# EAGLE design mainboard (EAGLE 9.6.2)
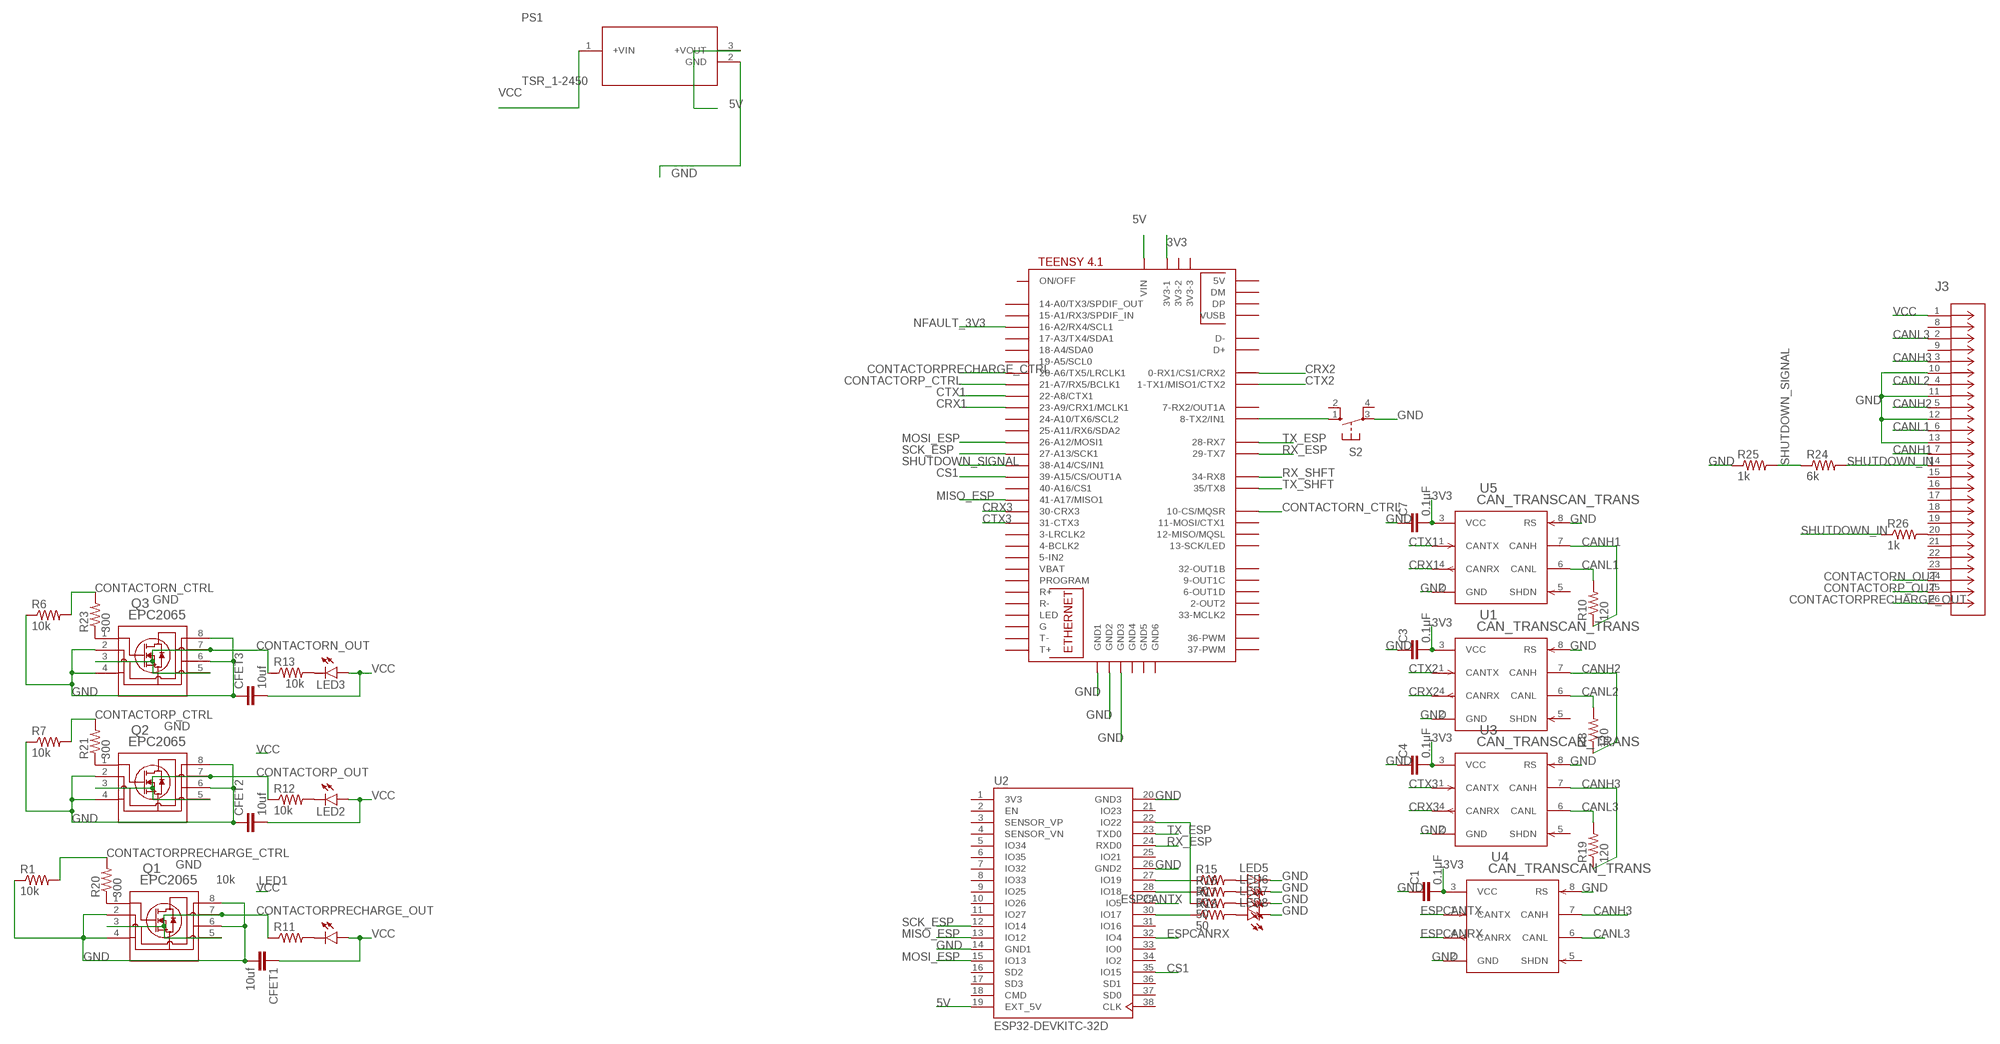
[diagram p0: schematic, sheet 1, part 1 of 2]
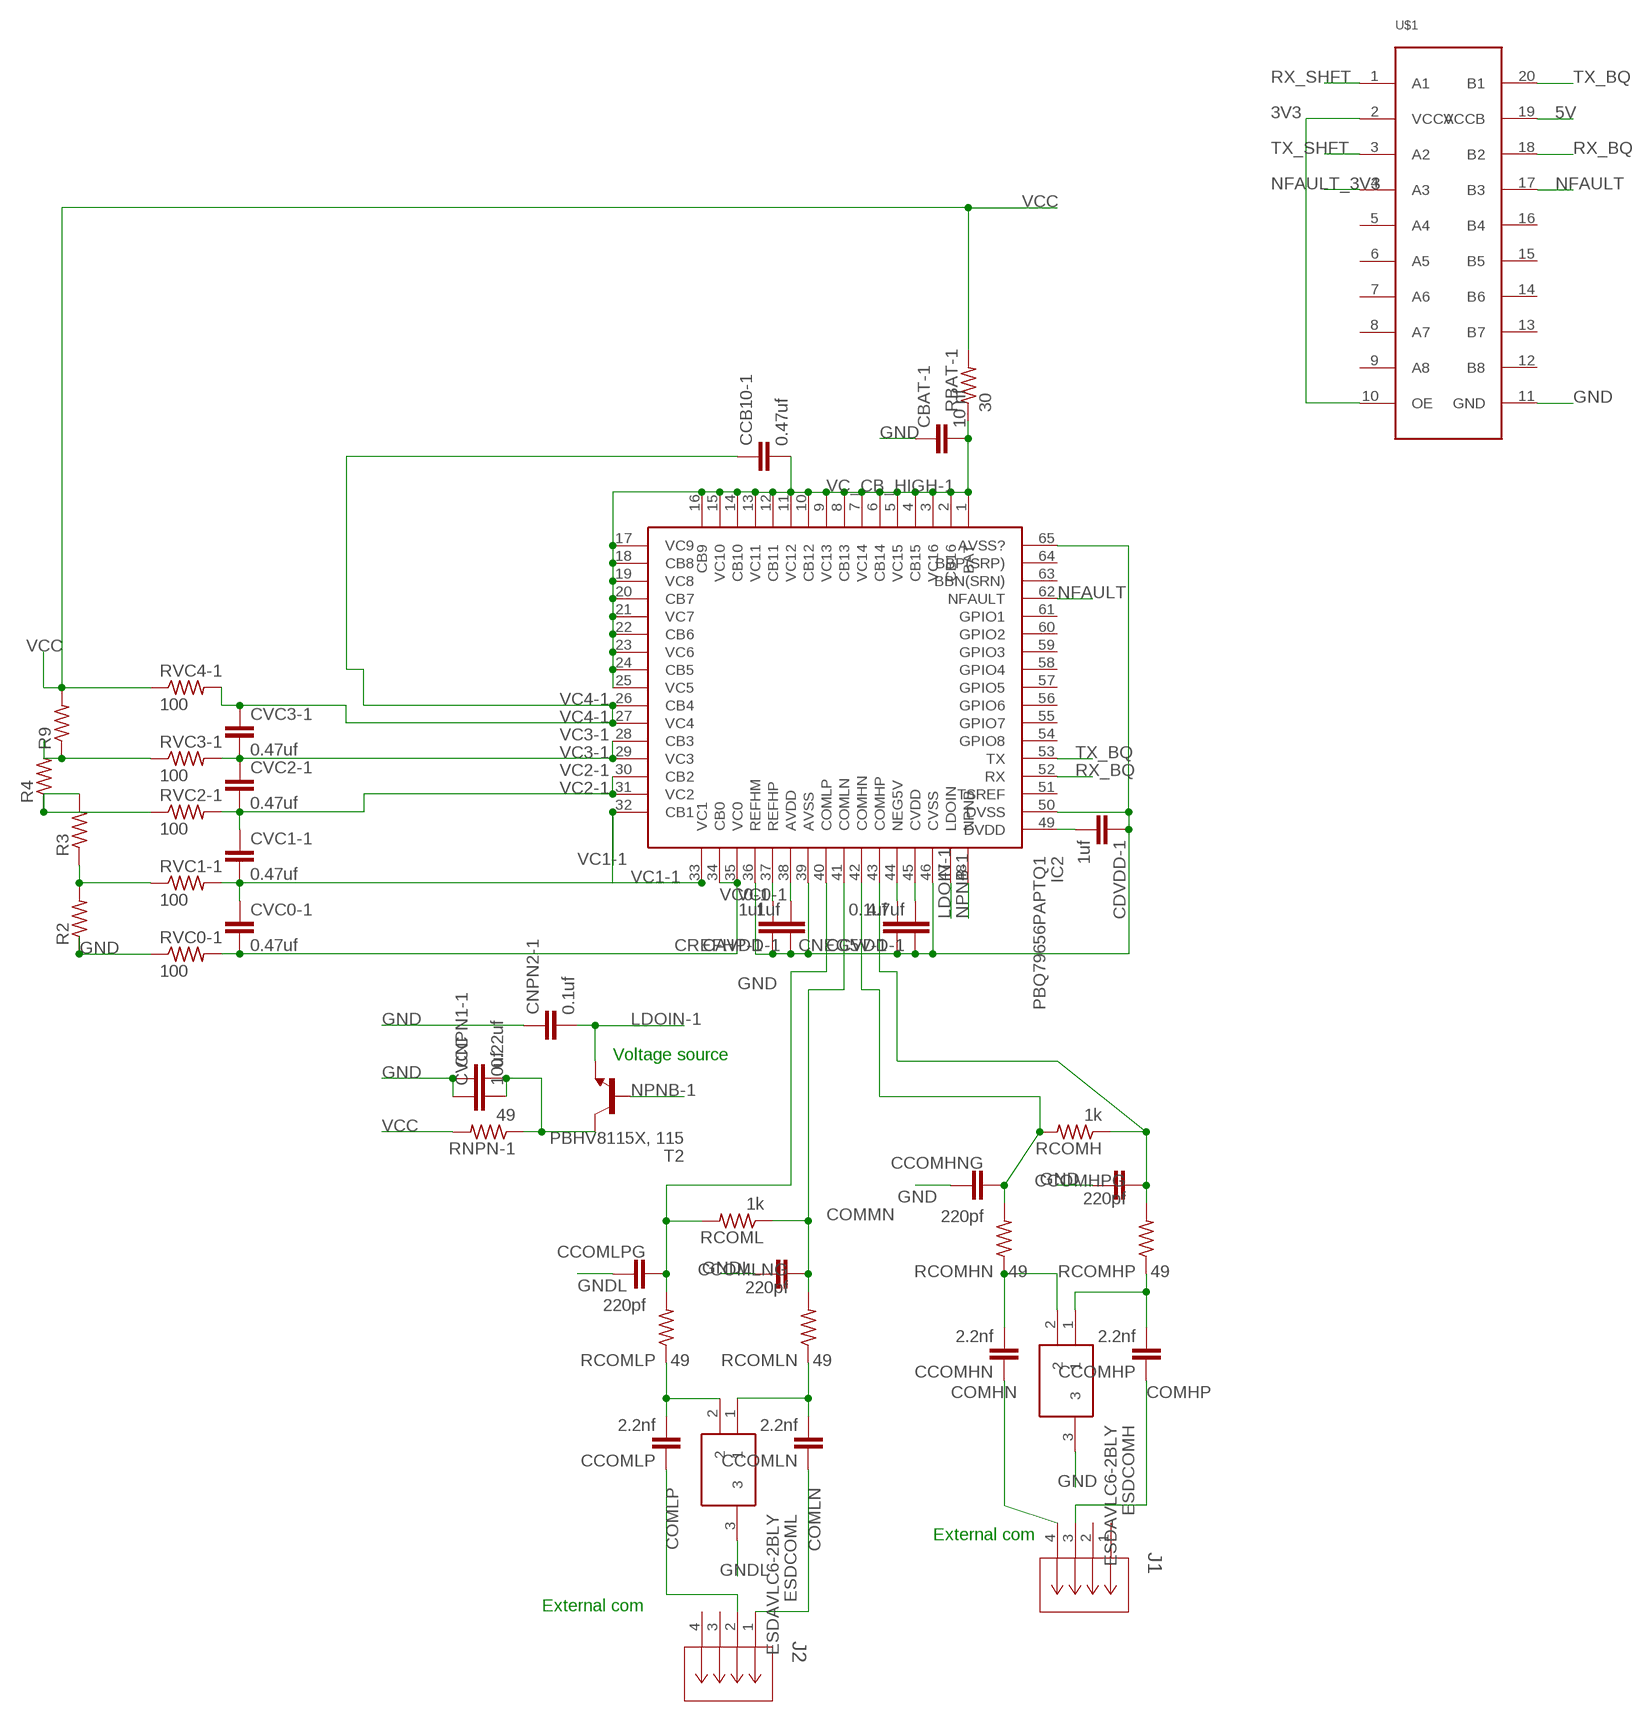
[diagram p1: schematic, sheet 1, part 2 of 2]

## Parts
C1  0.1μF  C-EUC0603  [C0603]
C3  0.1μF  C-EUC0603  [C0603]
C4  0.1μF  C-EUC0603  [C0603]
C7  0.1μF  C-EUC0603  [C0603]
CAVDD-1  1uf  C-EUC0603  [C0603]
CBAT-1  10 nf  C-EUC0603  [C0603]
CCB10-1  0.47uf  C-EUC0603  [C0603]
CCOMHN  2.2nf  C-EU075-032X103  [C075-032X103]
CCOMHNG  220pf  C-EUC0603  [C0603]
CCOMHP  2.2nf  C-EU075-032X103  [C075-032X103]
CCOMHPG  220pf  C-EUC0603  [C0603]
CCOMLN  2.2nf  C-EU075-032X103  [C075-032X103]
CCOMLNG  220pf  C-EUC0603  [C0603]
CCOMLP  2.2nf  C-EU075-032X103  [C075-032X103]
CCOMLPG  220pf  C-EUC0603  [C0603]
CCVDD-1  4.7uf  C-EUC0603  [C0603]
CDVDD-1  1uf  C-EUC0603  [C0603]
CFET1  10uf  C-EUC0805  [C0805]
CFET2  10uf  C-EUC0805  [C0805]
CFET3  10uf  C-EUC0805  [C0805]
CNEG5V-1  0.1uf  C-EUC0603  [C0603]
CNPN1-1  0.22uf  C-EUC0603  [C0603]
CNPN2-1  0.1uf  C-EUC0603  [C0603]
CREFHP-1  1uf  C-EUC0603  [C0603]
CVC0-1  0.47uf  C-EUC0603  [C0603]
CVC1-1  0.47uf  C-EUC0603  [C0603]
CVC2-1  0.47uf  C-EUC0603  [C0603]
CVC3-1  0.47uf  C-EUC0603  [C0603]
CVCC  10uf  C-EUC0805  [C0805]
ESDCOMH  ESDAVLC6-2BLY  [SOT95P255X150-3N]
ESDCOML  ESDAVLC6-2BLY  [SOT95P255X150-3N]
IC2  PBQ79656PAPTQ1  [QFP50P1200X1200X120-65N]
J1  DF11-4DP-2DSA(24)  [CON4_2X2_UF_DF11_HIR]
J2  DF11-4DP-2DSA(24)  [CON4_2X2_UF_DF11_HIR]
J3  TE_AMP_SURESEAL_26  [CONN26_6473423-1_TEC]
LED1  LEDSML0603  [SML0603]
LED2  LEDSML0603  [SML0603]
LED3  LEDSML0603  [SML0603]
LED5  LEDSML0603  [SML0603]
LED6  LEDSML0603  [SML0603]
LED7  LEDSML0603  [SML0603]
LED8  LEDSML0603  [SML0603]
PS1  TSR_1-2450  [TSR1-SINGLE_TRP]
Q1  EPC2065  [EPC2065_ECC]
Q2  EPC2065  [EPC2065_ECC]
Q3  EPC2065  [EPC2065_ECC]
R1  10k  R-US_R0603  [R0603]
R2  R-US_R0805  [R0805]
R3  R-US_R0805  [R0805]
R4  R-US_R0805  [R0805]
R6  10k  R-US_R0603  [R0603]
R7  10k  R-US_R0603  [R0603]
R8  120  R-US_R0603  [R0603]
R9  R-US_R0805  [R0805]
R10  120  R-US_R0603  [R0603]
R11  10k  R-US_R0603  [R0603]
R12  10k  R-US_R0603  [R0603]
R13  10k  R-US_R0603  [R0603]
R15  50  R-US_R0603  [R0603]
R16  50  R-US_R0603  [R0603]
R17  50  R-US_R0603  [R0603]
R18  50  R-US_R0603  [R0603]
R19  120  R-US_R0603  [R0603]
R20  300  R-US_R0603  [R0603]
R21  300  R-US_R0603  [R0603]
R23  300  R-US_R0603  [R0603]
R24  6k  R-US_R0603  [R0603]
R25  1k  R-US_R0603  [R0603]
R26  1k  R-US_R0603  [R0603]
RBAT-1  30  R-US_R0603  [R0603]
RCOMH  1k  R-US_R0603  [R0603]
RCOMHN  49  R-US_R0603  [R0603]
RCOMHP  49  R-US_R0603  [R0603]
RCOML  1k  R-US_R0603  [R0603]
RCOMLN  49  R-US_R0603  [R0603]
RCOMLP  49  R-US_R0603  [R0603]
RNPN-1  49  R-US_R0603  [R0603]
RVC0-1  100  R-US_R0603  [R0603]
RVC1-1  100  R-US_R0603  [R0603]
RVC2-1  100  R-US_R0603  [R0603]
RVC3-1  100  R-US_R0603  [R0603]
RVC4-1  100  R-US_R0603  [R0603]
S2  10-XX  [B3F-10XX]
T2  PBHV8115X, 115  BC868-NPN-SOT89-BCE  [SOT89-BCE]
U1  CAN_TRANSCAN_TRANS  [MAX3051ESA+]
U2  ESP32-DEVKITC-32D  [MODULE_ESP32-DEVKITC-32D]
U3  CAN_TRANSCAN_TRANS  [MAX3051ESA+]
U4  CAN_TRANSCAN_TRANS  [MAX3051ESA+]
U5  CAN_TRANSCAN_TRANS  [MAX3051ESA+]
U$1  TXB0108PWSMD  [TSSOP20]
U$3  TEENSY41  [TEENSY41]

## Nets
3V3: C1.2 C3.2 C4.2 C7.2 U1.3(VCC) U3.3(VCC) U4.3(VCC) U5.3(VCC) U$1.2(VCCA) U$1.10(OE) U$3.3V3-1
5V: PS1.3(+VOUT) U2.19(EXT_5V) U$1.19(VCCB) U$3.VIN
CANH1: J3.7 R10.1 U5.7(CANH)
CANH2: J3.5 R8.1 U1.7(CANH)
CANH3: J3.3 R19.1 U3.7(CANH) U4.7(CANH)
CANL1: J3.6 R10.2 U5.6(CANL)
CANL2: J3.4 R8.2 U1.6(CANL)
CANL3: J3.2 R19.2 U3.6(CANL) U4.6(CANL)
COMHN: CCOMHN.1 J1.4
COMHP: CCOMHP.1 J1.3
COMLN: CCOMLN.1 J2.1
COMLP: CCOMLP.1 J2.2
CONTACTORN_CTRL: R6.2 R23.2 U$3.10-CS\MQSR(10-CS/MQSR)
CONTACTORN_OUT: J3.24 Q3.3 Q3.5 Q3.7 R13.1
CONTACTORP_CTRL: R7.2 R21.2 U$3.21-A7/RX5/BCLK1
CONTACTORP_OUT: J3.25 Q2.3 Q2.5 Q2.7 R12.1
CONTACTORPRECHARGE_CTRL: R1.2 R20.2 U$3.20-A6/TX5/LRCLK1
CONTACTORPRECHARGE_OUT: J3.26 Q1.3 Q1.5 Q1.7 R11.1
CRX1: U5.4(CANRX) U$3.23-A9/CRX1/MCLK1
CRX2: U1.4(CANRX) U$3.0-RX1/CS1/CRX2
CRX3: U3.4(CANRX) U$3.30-CRX3
CS1: U2.35(IO15) U$3.39-A15/CS/OUT1A
CTX1: U5.1(CANTX) U$3.22-A8/CTX1
CTX2: U1.1(CANTX) U$3.1-TX1/MISO1/CTX2
CTX3: U3.1(CANTX) U$3.31-CTX3
CVDD-1: CCVDD-1.2 IC2.45(CVDD)
ESPCANRX: U2.32(IO4) U4.4(CANRX)
ESPCANTX: U2.29(IO5) U4.1(CANTX)
GND: C1.1 C3.1 C4.1 C7.1 CAVDD-1.1 CBAT-1.1 CCOMHNG.1 CCOMHPG.1 CCVDD-1.1 CDVDD-1.1 CFET1.2 CFET2.1 CFET3.1 CNEG5V-1.1 CNPN1-1.1 CNPN2-1.1 CREFHP-1.1 CVCC.1 ESDCOMH.3 IC2.36(REFHM) IC2.39(AVSS) IC2.46(CVSS) IC2.50(DVSS) IC2.65(AVSS?) J3.10 J3.11 J3.12 J3.13 LED5.C LED6.C LED7.C LED8.C PS1.2(GND) Q1.2 Q1.4 Q1.6 Q1.8 Q2.2 Q2.4 Q2.6 Q2.8 Q3.2 Q3.4 Q3.6 Q3.8 R1.1 R2.1 R6.1 R7.1 R25.1 RVC0-1.1 S2.3(P) U1.2(GND) U1.8(RS) U2.14(GND1) U2.20(GND3) U2.26(GND2) U3.2(GND) U3.8(RS) U4.2(GND) U4.8(RS) U5.2(GND) U5.8(RS) U$1.11(GND) U$3.GND1 U$3.GND2 U$3.GND3
GNDL: CCOMLNG.1 CCOMLPG.1 ESDCOML.3
LDOIN-1: CNPN2-1.2 IC2.47(LDOIN) T2.E
MISO_ESP: U2.13(IO12) U$3.41-A17/MISO1
MOSI_ESP: U2.15(IO13) U$3.26-A12/MOSI1
N$1: CCOMHP.2 ESDCOMH.1 RCOMHP.1
N$2: J3.20 R26.2
N$4: LED3.C R13.2
N$7: S2.1(S) U$3.8-TX2/IN1
N$8: CCOMHN.2 ESDCOMH.2 RCOMHN.1
N$9: LED2.C R12.2
N$10: CCOMLNG.2 IC2.41(COMLN) RCOML.1 RCOMLN.2
N$11: R17.1 U2.22(IO22)
N$13: LED1.C R11.2
N$15: Q1.1 R20.1
N$16: Q2.1 R21.1
N$28: R15.1 U2.27(IO19)
N$29: R16.1 U2.28(IO18)
N$30: Q3.1 R23.1
N$31: R18.1 U2.30(IO17)
N$32: LED5.A R15.2
N$33: LED6.A R16.2
N$34: LED7.A R17.2
N$35: LED8.A R18.2
N$49: CCOMLPG.2 IC2.40(COMLP) RCOML.2 RCOMLP.2
N$67: CCOMLP.2 ESDCOML.2 RCOMLP.1
N$68: CCOMLN.2 ESDCOML.1 RCOMLN.1
N$72: R3.2 R4.1 RVC2-1.1
N$73: R2.2 R3.1 RVC1-1.1
N$75: R4.2 R9.1 RVC3-1.1
N$111: CREFHP-1.2 IC2.37(REFHP)
N$112: CAVDD-1.2 IC2.38(AVDD)
N$113: CNEG5V-1.2 IC2.44(NEG5V)
N$114: CDVDD-1.2 IC2.49(DVDD)
N$130: CNPN1-1.2 CVCC.2 RNPN-1.1 T2.C
N$131: CCOMHPG.2 IC2.43(COMHP) RCOMH.1 RCOMHP.2
N$132: CCOMHNG.2 IC2.42(COMHN) RCOMH.2 RCOMHN.2
NFAULT: IC2.62(NFAULT) U$1.17(B3)
NFAULT_3V3: U$1.4(A3) U$3.16-A2/RX4/SCL1
NPNB-1: IC2.48(NPNB) T2.B
RX_BQ: IC2.52(RX) U$1.18(B2)
RX_ESP: U2.24(RXD0) U$3.29-TX7
RX_SHFT: U$1.1(A1) U$3.34-RX8
SCK_ESP: U2.12(IO14) U$3.27-A13/SCK1
SHUTDOWN_IN: J3.14 R24.2 R26.1
SHUTDOWN_SIGNAL: R24.1 R25.2 U$3.38-A14/CS/IN1
TX_BQ: IC2.53(TX) U$1.20(B1)
TX_ESP: U2.23(TXD0) U$3.28-RX7
TX_SHFT: U$1.3(A2) U$3.35-TX8(35/TX8)
VC0-1: CVC0-1.2 IC2.34(CB0) IC2.35(VC0) RVC0-1.2
VC1-1: CVC0-1.1 CVC1-1.2 IC2.32(CB1) IC2.33(VC1) RVC1-1.2
VC2-1: CVC1-1.1 CVC2-1.2 IC2.30(CB2) IC2.31(VC2) RVC2-1.2
VC3-1: CVC2-1.1 CVC3-1.2 IC2.28(CB3) IC2.29(VC3) RVC3-1.2
VC4-1: CCB10-1.1 CVC3-1.1 IC2.26(CB4) IC2.27(VC4) RVC4-1.2
VC_CB_HIGH-1: CBAT-1.2 CCB10-1.2 IC2.1(BAT) IC2.2(CB16) IC2.3(VC16) IC2.4(CB15) IC2.5(VC15) IC2.6(CB14) IC2.7(VC14) IC2.8(CB13) IC2.9(VC13) IC2.10(CB12) IC2.11(VC12) IC2.12(CB11) IC2.13(VC11) IC2.14(CB10) IC2.15(VC10) IC2.16(CB9) IC2.17(VC9) IC2.18(CB8) IC2.19(VC8) IC2.20(CB7) IC2.21(VC7) IC2.22(CB6) IC2.23(VC6) IC2.24(CB5) IC2.25(VC5) RBAT-1.1
VCC: CFET1.1 CFET2.2 CFET3.2 J3.1 LED1.A LED2.A LED3.A PS1.1(+VIN) R9.2 RBAT-1.2 RNPN-1.2 RVC4-1.1
Unconnected: IC2.51(TSREF) IC2.54(GPIO8) IC2.55(GPIO7) IC2.56(GPIO6) IC2.57(GPIO5) IC2.58(GPIO4) IC2.59(GPIO3) IC2.60(GPIO2) IC2.61(GPIO1) IC2.63(BBN(SRN)) IC2.64(BBP(SRP)) J1.1 J1.2 J2.3 J2.4 J3.8 J3.9 J3.15 J3.16 J3.17 J3.18 J3.19 J3.21 J3.22 J3.23 S2.2(S1) S2.4(P1) U1.5(SHDN) U2.2(EN) U2.3(SENSOR_VP) U2.4(SENSOR_VN) U2.5(IO34) U2.6(IO35) U2.7(IO32) U2.8(IO33) U2.9(IO25) U2.10(IO26) U2.11(IO27) U2.16(SD2) U2.17(SD3) U2.18(CMD) U2.21(IO23) U2.25(IO21) U2.31(IO16) U2.33(IO0) U2.34(IO2) U2.36(SD1) U2.37(SD0) U2.38(CLK) U3.5(SHDN) U4.5(SHDN) U5.5(SHDN) U$1.5(A4) U$1.6(A5) U$1.7(A6) U$1.8(A7) U$1.9(A8) U$1.12(B8) U$1.13(B7) U$1.14(B6) U$1.15(B5) U$1.16(B4) U$3.2-OUT2 U$3.3-LRCLK2 U$3.3V3-2 U$3.3V3-3 U$3.4-BCLK2 U$3.5-IN2 U$3.6-OUT1D U$3.7-RX2/OUT1A U$3.9-OUT1C U$3.11-MOSI/CTX1 U$3.12-MISO/MQSL U$3.13-SCK/LED U$3.14-A0/TX3/SPDIF_OUT U$3.15-A1/RX3/SPDIF_IN U$3.17-A3/TX4/SDA1 U$3.18-A4/SDA0 U$3.19-A5/SCL0 U$3.24-A10/TX6/SCL2 U$3.25-A11/RX6/SDA2 U$3.32-OUT1B U$3.33-MCLK2 U$3.36-PWM U$3.37-PWM U$3.40-A16/CS1 U$3.+5V(5V) U$3.D+ U$3.D- U$3.DM U$3.DP U$3.G U$3.GND4 U$3.GND5 U$3.GND6 U$3.LED U$3.ON/OFF U$3.PROGRAM U$3.R+ U$3.R- U$3.T+ U$3.T- U$3.VBAT U$3.VUSB

## Notes on the sheet
- Voltage source
- External com
- External com

## Power pins joined to a net without a drawn wire
3V3: U2.1(3V3)

## Library data of the parts
C1 C3 C4 C7 CAVDD-1 CBAT-1 CCB10-1 CCOMHN CCOMHNG CCOMHP CCOMHPG CCOMLN CCOMLNG CCOMLP CCOMLPG CCVDD-1 CDVDD-1 CFET1-CFET3 CNEG5V-1 CNPN1-1 CNPN2-1 CREFHP-1 CVC0-1 CVC1-1 CVC2-1 CVC3-1 CVCC = rcl:C-EU: CAPACITOR, European symbol; SPICEPREFIX: C
ESDCOMH ESDCOML = ESDAVLC6-2BLY:ESDAVLC6-2BLY: STMICROELECTRONICS - ESDAVLC6-2BLY - ESD Protection Device, 17 V, SOT-23, 3 Pins, 5 V, 140 W, ESDA Transil Series Source: Datasheet <http://www.st.com/resource/en/datasheet/esdavlc6-2bly.pdf>; DESCRIPTION: STMICROELECTRONICS - ESDAVLC6-2BLY - ESD Protection Device, 17 V, SOT-23, 3 Pins, 5 V, 140 W, ESDA Transil Series; HEIGHT: 1.5mm; MANUFACTURER_NAME: STMicroelectronics; MANUFACTURER_PART_NUMBER: ESDAVLC6-2BLY; MOUSER_PART_NUMBER: 511-ESDAVLC6-2BLY; MOUSER_PRICE-STOCK: https://www.mouser.co.uk/ProductDetail/STMicroelectronics/ESDAVLC6-2BLY?qs=l7cgNqFNU1iH2e21evvYsA%3D%3D
IC2 = PBQ79656PAPTQ1:PBQ79656PAPTQ1: BQ7965x-Q1 Family of 12S, 14S, 16S Precision Automotive Battery Monitor, Balancer and Integrated Hardware Protector with up to SafeTITM-26262 ASIL-D Compliance Source: Datasheet <http://www.ti.com/lit/ds/symlink/bq79616-q1.pdf>; DESCRIPTION: BQ7965x-Q1 Family of 12S, 14S, 16S Precision Automotive Battery Monitor, Balancer and Integrated Hardware Protector with up to SafeTITM-26262 ASIL-D Compliance; HEIGHT: 1.2mm; MANUFACTURER_NAME: Texas Instruments; MANUFACTURER_PART_NUMBER: PBQ79656PAPTQ1
J1 J2 = hirose_connectors:DF11-4DP-2DSA(24); COPYRIGHT: Copyright (C) 2023 Ultra Librarian. All rights reserved.; DIGI-KEY_PART_NUMBER_1: H10229-ND; MANUFACTURER_PART_NUMBER: DF11-4DP-2DSA(24); MFR_NAME: Hirose
J3 = TE_Sureseal:TE_AMP_SURESEAL_26; COPYRIGHT: Copyright (C) 2023 Ultra Librarian. All rights reserved.; DIGIKEY_PART_NUMBER_1: 6473423-1-ND; MANUFACTURER_PART_NUMBER: 6473423-1; MFR_NAME: TE Connectivity
LED1-LED3 LED5-LED8 = led:LED: LED OSRAM: - CHIPLED LG R971, LG N971, LY N971, LG Q971, LY Q971, LO R971, LY R971 LH N974, LH R974 LS Q976, LO Q976, LY Q976 LO Q996 - Hyper CHIPLED LW Q18S LB Q993, LB Q99A, LB R99A - SideLED LS A670, LO A670, LY A670, LG A670, LP A670 LB A673, LV A673, LT A673, LW A673 LH A674 LY A675 LS A676, LA A676, LO A676, LY A676, LW A676 LS A679, LY A679, LG A679 - Hyper Micro SIDELED® LS Y876, LA Y876, LO Y876, LY Y876 LT Y87S - SmartLED LW L88C, LW L88S LB L89C, LB L89S, LG L890 LS L89K, LO L89K, LY L89K LS L896, LA L896, LO L896, LY L896 - TOPLED LS T670, LO T670, LY T670, LG T670, LP T670 LSG T670, LSP T670, LSY T670, LOP T670, LYG T670 LG T671, LOG T671, LSG T671 LB T673, LV T673, LT T673, LW T673 LH T674 LS T676, LA T676, LO T676, LY T676, LB T676, LH T676, LSB T676, LW T676 LB T67C, LV T67C, LT T67C, LS T67K, LO T67K, LY T67K, LW E67C LS E67B, LA E67B, LO E67B, LY E67B, LB E67C, LV E67C, LT E67C LW T67C LS T679, LY T679, LG T679 LS T770, LO T770, LY T770, LG T770, LP T770 LB T773, LV T773, LT T773, LW T773 LH T774 LS E675, LA E675, LY E675, LS T675 LS T776, LA T776, LO T776, LY T776, LB T776 LHGB T686 LT T68C, LB T68C - Hyper Mini TOPLED® LB M676 - Mini TOPLED Santana® LG M470 LS M47K, LO M47K, LY M47K Source: http://www.osram.convergy.de LUXEON: - LUMILED® LXK2-PW12-R00, LXK2-PW12-S00, LXK2-PW14-U00, LXK2-PW14-V00 LXK2-PM12-R00, LXK2-PM12-S00, LXK2-PM14-U00 LXK2-PE12-Q00, LXK2-PE12-R00, LXK2-PE12-S00, LXK2-PE14-T00, LXK2-PE14-U00 LXK2-PB12-K00, LXK2-PB12-L00, LXK2-PB12-M00, LXK2-PB14-N00, LXK2-PB14-P00, LXK2-PB14-Q00 LXK2-PR12-L00, LXK2-PR12-M00, LXK2-PR14-Q00, LXK2-PR14-R00 LXK2-PD12-Q00, LXK2-PD12-R00, LXK2-PD12-S00 LXK2-PH12-R00, LXK2-PH12-S00 LXK2-PL12-P00, LXK2-PL12-Q00, LXK2-PL12-R00 Source: www.luxeon.com KINGBRIGHT: KA-3528ASYC Source: www.kingbright.com
PS1 = dcdc_5v:TSR_1-2450; COPYRIGHT: Copyright (C) 2023 Ultra Librarian. All rights reserved.; DIGI-KEY_PART_NUMBER_1: 1951-2747-ND; MANUFACTURER_PART_NUMBER: TSR 1-2450; MFR_NAME: Traco Power
Q1-Q3 = EPCGaNFET:EPC2065; COPYRIGHT: Copyright (C) 2023 Ultra Librarian. All rights reserved.; DIGIKEY_PART_NUMBER_1: 917-EPC2065TR-ND; DIGIKEY_PART_NUMBER_2: 917-EPC2065CT-ND; DIGIKEY_PART_NUMBER_3: 917-EPC2065DKR-ND; MANUFACTURER_PART_NUMBER: EPC2065; MFR_NAME: EPC
R1-R4 R6-R13 R15-R21 R23-R26 RBAT-1 RCOMH RCOMHN RCOMHP RCOML RCOMLN RCOMLP RNPN-1 RVC0-1 RVC1-1 RVC2-1 RVC3-1 RVC4-1 = rcl:R-US_: RESISTOR, American symbol; SPICEPREFIX: R
S2 = switch-omron:10-XX: OMRON SWITCH; MPN: B3F-1000; OC_FARNELL: 176432; OC_NEWARK: 36M3542
T2 = transistor:*-NPN-: NPN Transistror BF959 corrected 2008.03.06
U1 U3-U5 = NFR23_v1.1:CAN_TRANS; COPYRIGHT: Copyright (C) 2022 Ultra Librarian. All rights reserved.; DIGI-KEY_PART_NUMBER_1: MAX3051ESA+-ND; MANUFACTURER_PART_NUMBER: MAX3051ESA+; MFR_NAME: Maxim Integrated Products
U2 = ESP32-DEVKITC-32D:ESP32-DEVKITC-32D: Eval Board For Esp-Wroom-32 Check availability <https://pricing.snapeda.com/parts/ESP32-DEVKITC-32D/Espressif%20Systems/view-part?ref=eda>; AVAILABILITY: In Stock; DESCRIPTION: WiFi Development Tools (802.11) ESP32 General Development Kit, ESP32-WROOM-32D on the board; MF: Espressif Systems; MP: ESP32-DEVKITC-32D; PACKAGE: None; PRICE: None; PURCHASE-URL: https://pricing.snapeda.com/search/part/ESP32-DEVKITC-32D/?ref=eda
U$1 = TB0108:TXB0108PW
U$3 = teensy:TEENSY41

## Board
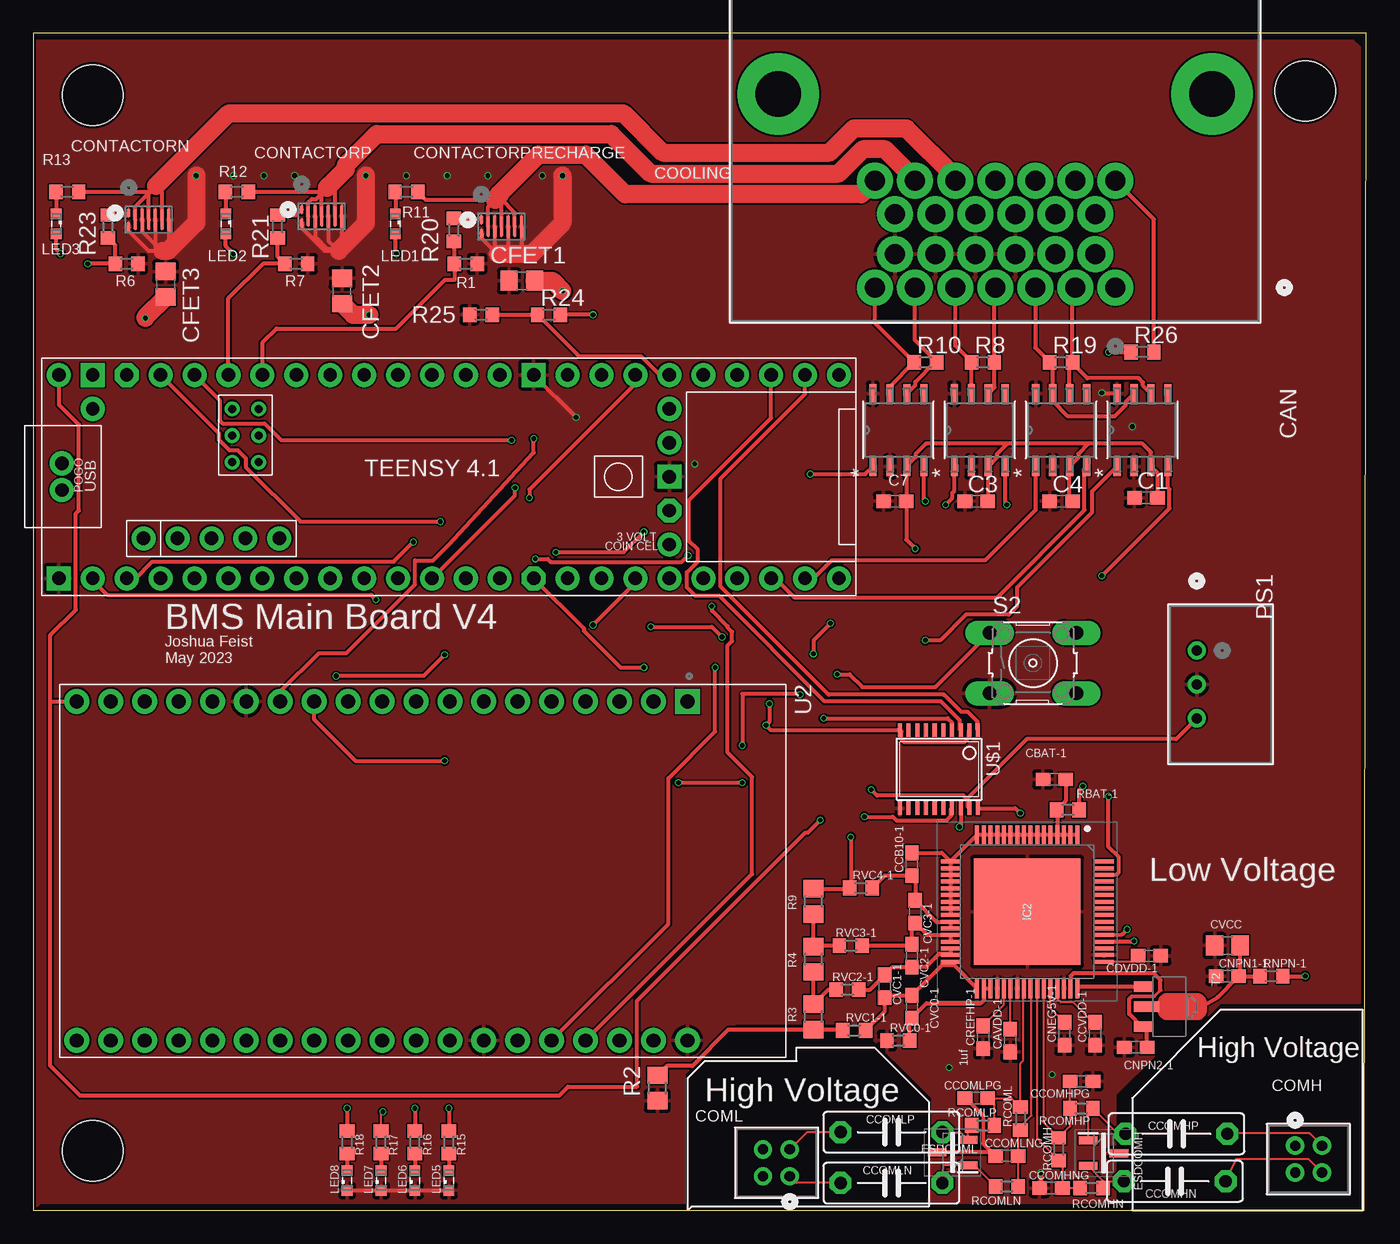
[diagram p2: board, top side]
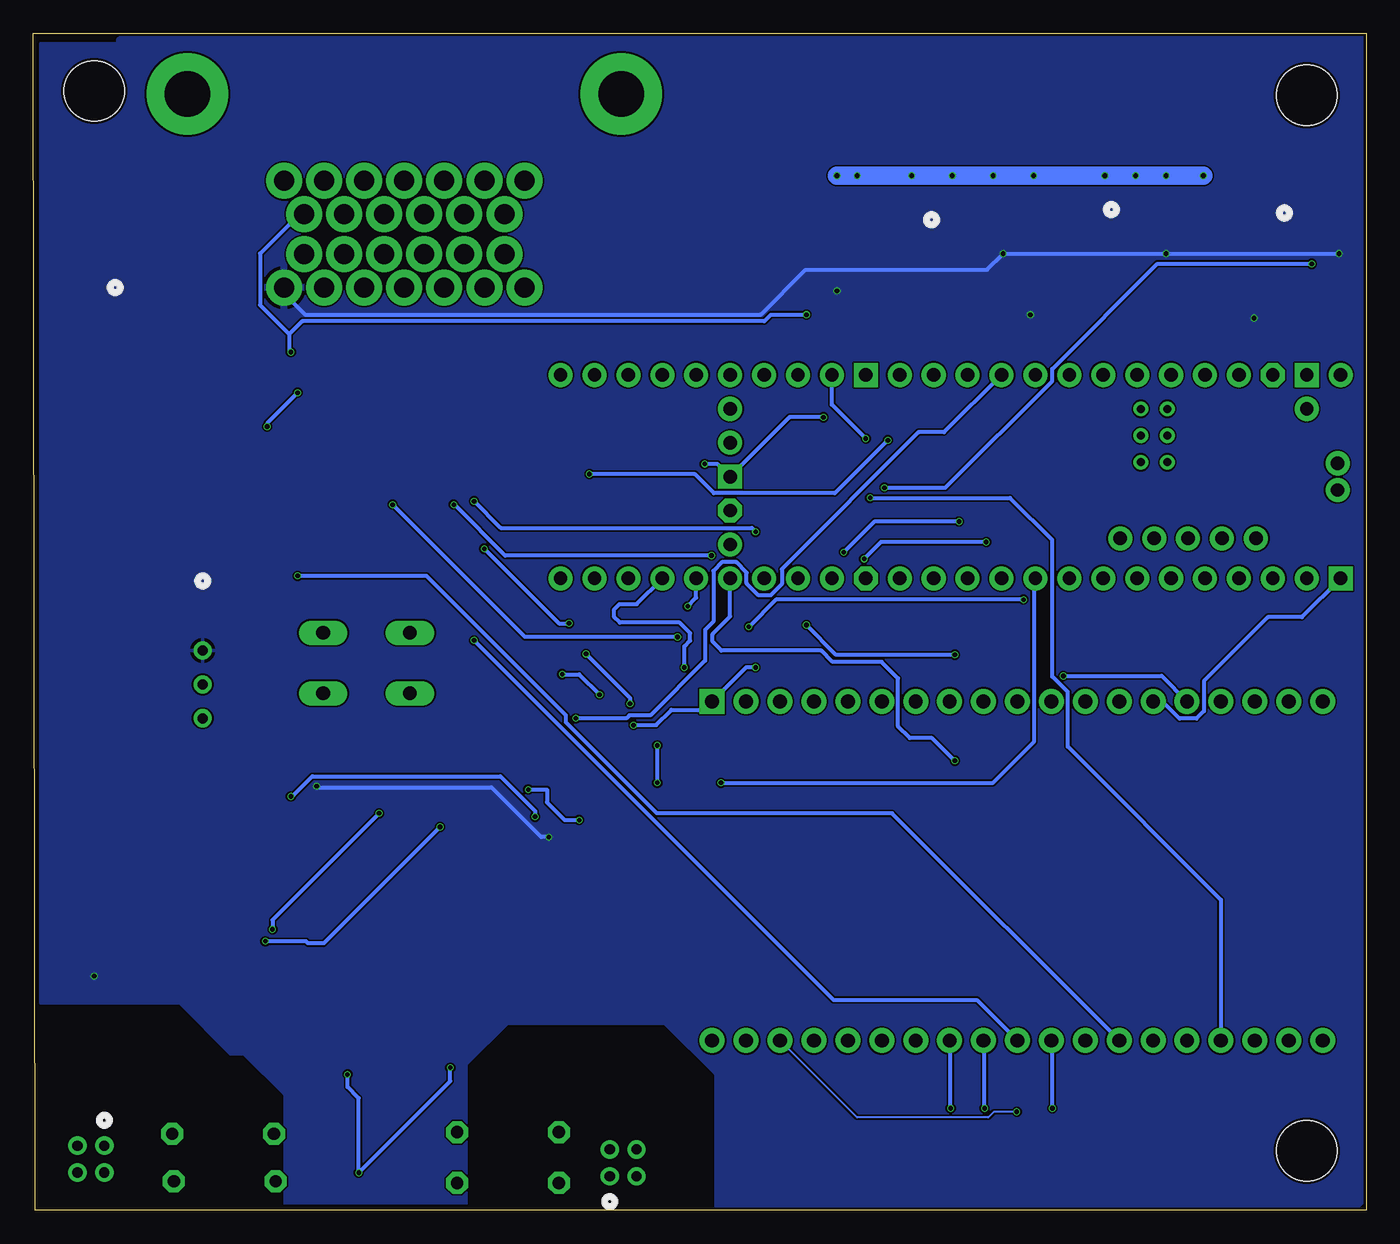
[diagram p3: board, bottom side, seen from below]

Size 99.8 x 88.13 mm. Coordinates in mm from the lower left corner, seen from the top.
Outline: 0,0 99.67,0 99.8,88.13 0,88.13 0,0
Copper layers (1*16): Top 0.035mm / dielectric 1.6mm / Bottom 0.035mm
Design rules "jlcpcb-2layers": minimum track width 5mil, minimum drill 0.3mm, track to track 5mil, track to pad 5mil, pad to pad 5mil, via to via 5mil, smd to smd 5mil, copper to edge 0.2mm, drill to drill 6mil, minimum pad ring 10mil, minimum via ring 3mil, stop-mask expansion 4mil, vias tented up to drill 0mil, thermal gap 10mil
Holes 4.52 mm at 4.45,4.45 95.25,83.82 4.45,83.5

### Footprints (pad centres in the part's own frame; a part is rotated, then mirrored left to right if it is on the bottom)
C0603 = smd 1.1 x 1: 1 -0.85,0; 2 0.85,0
C075-032X103 = drill 0.914 octagon: 1 -3.81,0; 2 3.81,0
C0805 = smd 1.3 x 1.5: 1 -0.95,0; 2 0.95,0
SOT95P255X150-3N = smd 1.4 x 0.6: 1 -1.15,0.95; 2 -1.15,-0.95; 3 1.15,0
QFP50P1200X1200X120-65N = smd 1.475 x 0.3: 1 -5.738,3.75; 2 -5.738,3.25; 3 -5.738,2.75; 4 -5.738,2.25; 5 -5.738,1.75; 6 -5.738,1.25; 7 -5.738,0.75; 8 -5.738,0.25; 9 -5.738,-0.25; 10 -5.738,-0.75; 11 -5.738,-1.25; 12 -5.738,-1.75; 13 -5.738,-2.25; 14 -5.738,-2.75; 15 -5.738,-3.25; 16 -5.738,-3.75; 33 5.738,-3.75; 34 5.738,-3.25; 35 5.738,-2.75; 36 5.738,-2.25; 37 5.738,-1.75; 38 5.738,-1.25; 39 5.738,-0.75; 40 5.738,-0.25; 41 5.738,0.25; 42 5.738,0.75; 43 5.738,1.25; 44 5.738,1.75; 45 5.738,2.25; 46 5.738,2.75; 47 5.738,3.25; 48 5.738,3.75 | smd 0.3 x 1.475: 17 -3.75,-5.738; 18 -3.25,-5.738; 19 -2.75,-5.738; 20 -2.25,-5.738; 21 -1.75,-5.738; 22 -1.25,-5.738; 23 -0.75,-5.738; 24 -0.25,-5.738; 25 0.25,-5.738; 26 0.75,-5.738; 27 1.25,-5.738; 28 1.75,-5.738; 29 2.25,-5.738; 30 2.75,-5.738; 31 3.25,-5.738; 32 3.75,-5.738; 49 3.75,5.738; 50 3.25,5.738; 51 2.75,5.738; 52 2.25,5.738; 53 1.75,5.738; 54 1.25,5.738; 55 0.75,5.738; 56 0.25,5.738; 57 -0.25,5.738; 58 -0.75,5.738; 59 -1.25,5.738; 60 -1.75,5.738; 61 -2.25,5.738; 62 -2.75,5.738; 63 -3.25,5.738; 64 -3.75,5.738 | smd 8 x 8: 65 0,0
CON4_2X2_UF_DF11_HIR = drill 0.762 pad 1.27: 1 0,0; 2 0,2.007; 3 -2.007,0; 4 -2.007,2.007
CONN26_6473423-1_TEC = drill 1.499 pad 2.007: 1 0,0; 2 2.997,0; 3 5.994,0; 4 8.992,0; 5 11.989,0; 6 15.011,0; 7 18.009,0; 8 1.499,-2.489; 9 4.496,-2.489; 10 7.493,-2.489; 11 10.49,-2.489; 12 13.487,-2.489; 13 16.51,-2.489; 14 1.499,-5.512; 15 4.496,-5.512; 16 7.493,-5.512; 17 10.49,-5.512; 18 13.487,-5.512; 19 16.51,-5.512; 20 0,-8.001; 21 2.997,-8.001; 22 5.994,-8.001; 23 8.992,-8.001; 24 11.989,-8.001; 25 15.011,-8.001; 26 18.009,-8.001 | drill 3.404 pad 3.404: 27 -7.239,-14.503; 28 25.248,-14.503
SML0603 = smd 0.8 x 0.8: A 0.75,0; C -0.75,0
TSR1-SINGLE_TRP = drill 0.762 pad 1.27: 1 0,0; 2 2.54,0; 3 5.08,0
EPC2065_ECC = smd 0.229 x 0.762: 1 -1.5,0.512; 2 -1.5,-0.512 | smd 0.229 x 1.6: 3 -1,0; 5 0,0; 7 1,0 | smd 0.229 x 1.778: 4 -0.5,0; 6 0.5,0; 8 1.5,0
R0603 = smd 1 x 1.1: 1 -0.85,0; 2 0.85,0
R0805 = smd 1.3 x 1.5: 1 -0.95,0; 2 0.95,0
B3F-10XX = drill 1.016 long: 1 -3.251,2.261; 2 3.251,2.261; 3 -3.251,-2.261; 4 3.251,-2.261
SOT89-BCE = smd 0.8 x 1.4: B -1.499,-1.981; E 1.499,-1.981 | smd 0.8 x 1.9: C 0,-1.727
MAX3051ESA+ = smd 1.46 x 0.533: 1 -2.724,1.905; 2 -2.724,0.635; 3 -2.724,-0.635; 4 -2.724,-1.905; 5 2.724,-1.905; 6 2.724,-0.635; 7 2.724,0.635; 8 2.724,1.905
MODULE_ESP32-DEVKITC-32D = drill 1.04 square: 1 -12.7,19.76 | drill 1.04: 2 -12.7,17.22; 3 -12.7,14.68; 4 -12.7,12.14; 5 -12.7,9.6; 6 -12.7,7.06; 7 -12.7,4.52; 8 -12.7,1.98; 9 -12.7,-0.56; 10 -12.7,-3.1; 11 -12.7,-5.64; 12 -12.7,-8.18; 13 -12.7,-10.72; 14 -12.7,-13.26; 15 -12.7,-15.8; 16 -12.7,-18.34; 17 -12.7,-20.88; 18 -12.7,-23.42; 19 -12.7,-25.96; 20 12.7,19.76; 21 12.7,17.22; 22 12.7,14.68; 23 12.7,12.14; 24 12.7,9.6; 25 12.7,7.06; 26 12.7,4.52; 27 12.7,1.98; 28 12.7,-0.56; 29 12.7,-3.1; 30 12.7,-5.64; 31 12.7,-8.18; 32 12.7,-10.72; 33 12.7,-13.26; 34 12.7,-15.8; 35 12.7,-18.34; 36 12.7,-20.88; 37 12.7,-23.42; 38 12.7,-25.96
TSSOP20 = smd 0.305 x 0.991: 1 -2.925,-2.918; 2 -2.275,-2.918; 3 -1.625,-2.918; 4 -0.975,-2.918; 5 -0.325,-2.918; 6 0.325,-2.918; 7 0.975,-2.918; 8 1.625,-2.918; 9 2.275,-2.918; 10 2.925,-2.918; 11 2.925,2.918; 12 2.275,2.918; 13 1.625,2.918; 14 0.975,2.918; 15 0.325,2.918; 16 -0.325,2.918; 17 -0.975,2.918; 18 -1.625,2.918; 19 -2.275,2.918; 20 -2.925,2.918
TEENSY41 = drill 1: 0-RX1/CS1/CRX2 -27.94,-7.62; 1-TX1/MISO1/CTX2 -25.4,-7.62; 2-OUT2 -22.86,-7.62; 3-LRCLK2 -20.32,-7.62; 4-BCLK2 -17.78,-7.62; 5-IN2 -15.24,-7.62; 6-OUT1D -12.7,-7.62; 7-RX2/OUT1A -10.16,-7.62; 8-TX2/IN1 -7.62,-7.62; 9-OUT1C -5.08,-7.62; 10-CS\MQSR -2.54,-7.62; 11-MOSI/CTX1 0,-7.62; 12-MISO/MQSL 2.54,-7.62; 13-SCK/LED 2.54,7.62; 14-A0/TX3/SPDIF_OUT 0,7.62; 15-A1/RX3/SPDIF_IN -2.54,7.62; 16-A2/RX4/SCL1 -5.08,7.62; 17-A3/TX4/SDA1 -7.62,7.62; 18-A4/SDA0 -10.16,7.62; 19-A5/SCL0 -12.7,7.62; 20-A6/TX5/LRCLK1 -15.24,7.62; 21-A7/RX5/BCLK1 -17.78,7.62; 22-A8/CTX1 -20.32,7.62; 23-A9/CRX1/MCLK1 -22.86,7.62; 24-A10/TX6/SCL2 7.62,-7.62; 25-A11/RX6/SDA2 10.16,-7.62; 26-A12/MOSI1 12.7,-7.62; 27-A13/SCK1 15.24,-7.62; 28-RX7 17.78,-7.62; 29-TX7 20.32,-7.62; 30-CRX3 22.86,-7.62; 31-CTX3 25.4,-7.62; 32-OUT1B 27.94,-7.62; 33-MCLK2 27.94,7.62; 34-RX8 25.4,7.62; 35-TX8 22.86,7.62; 36-PWM 20.32,7.62; 37-PWM 17.78,7.62; 38-A14/CS/IN1 15.24,7.62; 39-A15/CS/OUT1A 12.7,7.62; 40-A16/CS1 10.16,7.62; 41-A17/MISO1 7.62,7.62; +5V -24.13,-4.62; D+ -30.25,-1; D- -30.25,1; DM -21.59,-4.62; DP -19.05,-4.62; GND4 -16.51,-4.62; GND5 -13.97,-4.62; ON/OFF 15.24,5.08; PROGRAM 15.24,2.54; VBAT 15.24,-5.08; VUSB -27.94,5.08 | drill 1 octagon: 3V3-1 5.08,-7.62; 3V3-2 15.24,-2.54; 3V3-3 -25.4,7.62 | drill 0.6: G -15.51,3.08; LED -17.51,3.08; R+ -17.51,5.08; R- -15.51,5.08; T+ -15.51,1.08; T- -17.51,1.08 | drill 1 square: GND1 -30.48,-7.62; GND2 15.24,0; GND3 5.08,7.62; GND6 -27.94,7.62 | drill 1 pad 1.676: VIN -30.48,7.62

### Placement (x,y rotation side)
C1  83.31,53.34 0 top
C3  70.61,53.09 0 top
C4  76.96,53.09 0 top
C7  64.52,53.09 0 top
CAVDD-1  73.15,12.7 90 top
CBAT-1  76.45,32.26 0 top
CCB10-1  65.79,25.91 90 top
CCOMHN  85.47,2.16 180 top
CCOMHNG  76.2,1.65 0 top
CCOMHP  85.6,5.71 180 top
CCOMHPG  78.49,9.65 180 top
CCOMLN  64.26,2.03 0 top
CCOMLNG  72.9,4.06 0 top
CCOMLP  64.26,5.84 0 top
CCOMLPG  70.61,8.38 0 top
CCVDD-1  79.5,13.21 90 top
CDVDD-1  83.57,19.05 180 top
CFET1  36.58,69.6 180 top
CFET2  23.11,68.83 270 top
CFET3  9.91,69.34 270 top
CNEG5V-1  77.22,13.21 90 top
CNPN1-1  89.41,17.53 0 top
CNPN2-1  82.55,12.19 0 top
CREFHP-1  71.12,12.95 90 top
CVC0-1  65.79,15.24 270 top
CVC1-1  63.75,16.76 270 top
CVC2-1  65.79,19.05 270 top
CVC3-1  66.04,22.35 270 top
CVCC  89.41,19.81 0 top
ESDCOMH  80.14,4.27 0 top
ESDCOML  68.83,4.32 180 top
IC2  74.42,22.35 270 top
J1  94.49,4.83 180 top
J2  56.64,2.54 0 top
J3  81.03,69.09 180 top
LED1  27.11,73.85 270 top
LED2  14.41,73.85 270 top
LED3  1.71,73.85 270 top
LED5  31.11,2.22 90 top
LED6  28.57,2.22 90 top
LED7  26.04,2.22 90 top
LED8  23.5,2.22 90 top
PS1  87.12,41.91 270 top
Q1  35.05,73.66 0 top
Q2  21.59,74.42 0 top
Q3  8.64,74.17 0 top
R1  32.38,70.87 180 top
R2  46.74,9.14 90 top
R3  58.42,14.48 90 top
R4  58.42,18.8 90 top
R6  6.99,70.87 180 top
R7  19.68,70.87 180 top
R8  71.12,63.5 0 top
R9  58.42,23.11 90 top
R10  66.8,63.5 0 top
R11  27.94,76.26 180 top
R12  15.24,76.26 180 top
R13  2.54,76.26 180 top
R15  31.11,5.08 270 top
R16  28.57,5.08 270 top
R17  26.04,5.08 270 top
R18  23.5,5.08 270 top
R19  76.96,63.5 0 top
R20  31.5,73.41 270 top
R21  18.29,73.66 270 top
R23  5.59,73.66 270 top
R24  38.61,67.06 0 top
R25  33.53,67.06 0 top
R26  83.06,64.26 0 top
RBAT-1  77.47,29.97 0 top
RCOMH  76.78,4.57 270 top
RCOMHN  79.25,1.65 180 top
RCOMHP  78.49,7.62 180 top
RCOML  73.91,6.86 90 top
RCOMLN  72.9,1.78 0 top
RCOMLP  71.12,6.35 0 top
RNPN-1  92.71,17.53 0 top
RVC0-1  64.77,12.7 0 top
RVC1-1  61.47,13.46 0 top
RVC2-1  60.96,16.51 0 top
RVC3-1  61.21,19.81 0 top
RVC4-1  61.98,24.13 0 top
S2  74.85,40.97 0 top
T2  85.09,15.24 270 top
U1  70.87,58.42 90 top
U2  29.21,25.4 270 top
U3  76.96,58.42 90 top
U4  83.06,58.42 90 top
U5  64.77,58.42 90 top
U$1  67.82,33.02 180 top
U$3  32.38,54.93 0 top

### Tracks (layer width: path | path; a pad name or v marks a point on that pad's centre or on a via)
3V3  (via drill 0.35)
  Top 0.305: U$3.3V3-1 41.23,43.55 41.23,43.38 43.97,40.64 v45.72,40.64 | U$1.2 70.03,35.87 70.03,35.37 69.7,35.04 65.21,35.04 65.01,35.24 65.01,35.82 U$1.10 55.25,35.94 v54.86,36.32 55.12,36.58 v55.12,37.92 | C3.2 71.46,55.66 U1.3 72.15,56.34 72.15,56.6 72.95,57.4 | C1.2 84.16,55.23 U4.3 83.69,56.77 83.06,57.4 79.02,57.4 | C4.2 77.6,53.3 U3.3 78.25,56.34 78.25,56.63 79.02,57.4 | 79.02,57.4 72.95,57.4 | 72.95,57.4 66.85,57.4 66.05,56.6 66.05,56.39 65.41,55.75 U5.3 65.37,55.66 C7.2 65.37,50.2 v66.04,49.53 | v59.69,43.94 58.42,42.67 v58.42,41.66
  Bottom 0.305: v45.72,40.64 46.43,40.64 U2.1 49.6,37.47 52.02,37.47 53.17,36.32 v54.86,36.32 | v66.04,49.53 60.45,43.94 v59.69,43.94 | v58.42,41.66 55.12,38.35 v55.12,37.92
5V  (via drill 0.35)
  Top 0.305: 1.27,38.1 1.27,10.79 3.49,8.57 39.37,8.57 40.04,9.24 45.21,9.24 45.21,15.68 57.78,28.26 57.98,28.26 v58.93,29.21 | 1.27,38.1 1.27,43.05 3.17,44.96 3.17,52.16 3.4,52.38 3.4,58.83 1.91,60.33 U$3.VIN | 1.27,38.1 U2.19 | 69.87,30.88 69.98,30.77 69.98,30.22 U$1.19 | v62.74,31.5 63.18,31.05 69.67,31.05 69.84,30.88 69.87,30.88 | 69.87,30.88 70,30.88 74.4,35.28 85.57,35.28 PS1.3
  Bottom 0.305: v62.74,31.5 61.34,31.5 61.34,30.54 60.01,29.21 v58.93,29.21
CANH1
  Top 0.305: U5.7 64.14,61.68 R10.1 63.02,66.44 J3.7
CANH2
  Top 0.305: U1.7 70.23,63.46 R8.1 69.04,64.73 J3.5
CANH3
  Top 0.305: U4.7 81.78,60.5 81.78,60.26 80.95,59.44 77.47,59.44 76.33,60.58 U3.7 76.33,63.28 R19.1 75.03,64.58 J3.3
CANL1
  Top 0.305: U5.6 66.04,61.78 66.04,62.02 67.53,63.5 R10.2 66.02,65.14 J3.6
CANL2
  Top 0.305: U1.6 71.97,61.61 R8.2 71.97,69.02 J3.4
CANL3
  Top 0.305: U3.6 77.6,63.28 77.77,63.46 | 77.77,63.46 R19.2 77.81,68.87 J3.2 | 77.77,63.46 78.92,62.31 82.77,62.31 83.1,61.98 83.1,61.74 U4.6
COMHN
  Top 0.152: CCOMHN.1 90.06,3.81 95.5,3.81 J1.4
COMHP
  Top 0.152: CCOMHP.1 89.42,5.74 95.58,5.74 J1.3
COMLN
  Top 0.152: CCOMLN.1 57.15,2.03 J2.1
COMLP
  Top 0.152: CCOMLP.1 57.94,5.84 J2.2
CONTACTORN_CTRL  (via drill 0.35)
  Top 0.305: U$3.10-CS\MQSR 36.07,53.53 v36.07,54.1 | v4.06,70.87 4.11,70.92 6.18,70.92 R6.2 6.13,72.26 R23.2
  Bottom 0.305: v36.07,54.1 31.51,54.1 23.51,62.1 23.51,62.99 15.63,70.87 v4.06,70.87
CONTACTORN_OUT
  Top 0.305: Q3.7 9.64,76.22 9.27,76.58 | 9.27,76.58 9.17,76.68 8.64,76.15 | Q3.5 8.64,76.15 | Q3.3 7.64,75.15 8.64,76.15 | R13.1 8.95,76.26 9.27,76.58
  Top 1.346: J3.24 69.04,77.34 65.39,80.99 61.41,80.99 59.62,79.21 47.13,79.21 44.19,82.14 14.63,82.14 9.17,76.68
CONTACTORP_CTRL
  Top 0.305: U$3.21-A7/RX5/BCLK1 14.61,68.28 17.19,70.87 R7.2 18.29,71.41 R21.2
CONTACTORP_OUT
  Top 0.305: Q2.7 22.59,76.42 22.23,76.79 | Q2.5 21.59,76.15 | 21.59,76.15 21.7,76.26 | 21.7,76.26 22,76.56 | 21.59,76.15 21.16,75.72 20.84,75.72 20.59,75.47 Q2.3 | R12.1 21.7,76.26
  Top 1.346: 22.23,76.79 23.39,77.95 23.39,78.27 25.72,80.59 43.27,80.59 46.23,77.63 60.3,77.63 62.11,79.44 63.77,79.44 66.02,77.2 J3.25
  Top 1.372: 22,76.56 22.23,76.79
CONTACTORPRECHARGE_CTRL
  Top 0.305: U$3.20-A6/TX5/LRCLK1 17.14,64.96 18.21,66.03 27.18,66.03 30.8,69.65 31.54,69.65 R1.2 31.54,72.52 R20.2
CONTACTORPRECHARGE_OUT
  Top 0.305: Q1.3 34.05,75.15 34.57,75.67 29.39,75.67 R11.1 | Q1.5 35.05,75.69 | 35.05,75.69 35.05,75.9 34.92,76.02 34.86,76.09 | Q1.7 36.05,74.69 35.05,75.69
  Top 1.346: 34.86,76.09 37.82,79.05 41.35,79.05 44.32,76.07 62,76.07 J3.26
  Top 1.372: 34.57,75.67 34.92,76.02
CRX1  (via drill 0.35)
  Top 0.305: U$3.23-A9/CRX1/MCLK1 13.89,58.18 13.89,57.7 14.68,56.92 15.31,56.92 15.91,56.31 15.91,55.65 20,51.56 v30.48,51.56 | v39.12,49.28 44.2,49.28 v45.72,50.8 | v66.8,53.09 66.67,53.21 U5.4
  Bottom 0.305: v30.48,51.56 36.83,51.56 v39.12,49.28 | v45.72,50.8 46,51.08 64.8,51.08 v66.8,53.09
CRX2  (via drill 0.35)
  Top 0.305: v25.65,45.72 25.3,46.07 5.53,46.07 4.45,47.16 U$3.0-RX1/CS1/CRX2 | v46.23,43.69 50.8,43.69 v51.56,42.93 | v72.9,52.83 72.77,52.96 U1.4
  Bottom 0.305: v25.65,45.72 44.2,45.72 v46.23,43.69 | v51.56,42.93 62.99,42.93 v72.9,52.83
CRX3
  Top 0.305: U$3.30-CRX3 55.58,47.31 56.99,45.89 72.18,45.89 78.72,52.43 78.72,55.55 U3.4
CS1  (via drill 0.35)
  Top 0.305: U$3.39-A15/CS/OUT1A 45.09,61.91 37.15,53.98 v37.15,53.34
  Bottom 0.305: v37.15,53.34 26.67,53.34 23.5,50.16 23.5,39.96 22.34,38.81 22.34,34.72 10.87,23.25 U2.35
CTX1  (via drill 0.35)
  Top 0.305: U$3.22-A8/CTX1 13.94,60.67 13.94,59.14 14.17,58.92 17.31,58.92 18.57,57.66 v35.81,57.66 | v58.17,55.12 62.29,55.12 U5.1
  Bottom 0.305: v58.17,55.12 50.26,55.12 48.84,53.69 39.78,53.69 v35.81,57.66
CTX2  (via drill 0.35)
  Top 0.305: U$3.1-TX1/MISO1/CTX2 7.65,47.31 8.91,48.57 26.98,48.57 v28.45,50.04 | v37.59,48.77 38.51,48.77 38.73,48.54 48.54,48.54 v49.02,49.02 | v68.33,52.83 68.81,53.31 68.81,53.71 68.96,53.87 U1.1
  Bottom 0.305: v28.45,50.04 36.32,50.04 v37.59,48.77 | v49.02,49.02 64.47,49.02 68.28,52.83 v68.33,52.83
CTX3
  Top 0.305: U$3.31-CTX3 58.42,47.31 59.78,48.67 71.28,48.67 75.06,52.45 U3.1
CVDD-1
  Top 0.152: IC2.45 76.72,16.57 76.72,15.76 76.93,15.55 77.86,15.55 79.35,14.06 CCVDD-1.2
ESPCANRX  (via drill 0.35)
  Top 0.305: U4.4 84.96,54.1 85.07,53.99 85.07,52.56 v80.01,47.5
  Bottom 0.305: U2.32 35.51,29.72 53.11,29.72 59.92,36.52 59.92,37.06 70.36,47.5 v80.01,47.5
ESPCANTX  (via drill 0.35)
  Top 0.305: U4.1 79.28,53.82 79.28,52.24 73.66,46.63 73.66,45.21 73.05,44.6 69.84,44.6 67.91,42.67 v66.8,42.67
  Bottom 0.305: v66.8,42.67 39.88,15.75 29.16,15.75 U2.29
GND  (via drill 0.35)
  Top 0.305: U$3.GND3 v40.64,59.37 | LED8.C LED7.C LED6.C LED5.C | v75.44,2.79 75.44,1.74 CCOMHNG.1 | Q1.2 33.56,72.8 34.55,71.81 34.55,71.88 | 34.8,71.63 34.8,71.64 34.55,71.88 | Q1.4 34.55,71.88 | Q1.6 35.55,71.64 35.56,71.63 | Q1.8 36.55,71.65 36.58,71.63 | Q3.2 7.12,73.64 7.12,73.33 8.61,71.84 9.4,71.84 | 9.4,71.84 9.65,71.84 | Q3.4 8.14,73.28 9.4,72.03 9.4,71.84 | Q3.6 9.14,72.11 9.4,71.84 | Q3.8 10.14,71.89 10.09,71.84 | Q2.8 23.09,72.07 22.86,71.84 | Q2.6 22.09,72.61 22.71,71.99 | 22.71,71.99 22.86,71.84 | Q2.4 21.09,72.91 21.08,72.9 21.99,71.99 22.71,71.99 | Q2.2 20.12,73.88 20.12,73.54 21.81,71.84 22.86,71.84 | U4.8 80.08,61.14 v80.01,61.21
  Top 1.346: v39.62,77.47 39.62,73.91 37.34,71.63 36.58,71.63 35.56,71.63 34.8,71.63 | v24.89,77.47 24.89,73.88 22.86,71.84 | v12.19,77.47 12.19,73.95 10.09,71.84 9.65,71.84
  Bottom 0.305: v40.64,59.37 43.18,59.37 U$3.GND2 48.58,55.88 v49.53,55.88 | U$3.GND1 4.81,44.4 7.36,44.4 12.15,39.62 12.15,37.37 12.71,36.81 13.99,36.81 15.27,38.1 U2.14 | v68.58,10.67 68.58,9.65 v75.44,2.79 75.44,8.38 76.28,9.22 v76.28,10.16 | v80.01,61.21 82.3,58.93 v82.3,58.67
  Bottom 1.372: v12.19,77.47 v14.99,77.47 v17.27,77.47 v19.56,77.47 v24.89,77.47 v27.94,77.47 v30.99,77.47 v34.04,77.47 v38.1,77.47 v39.62,77.47
  pour Top: 99.31,15.49 88.9,15.49 85.09,11.68 84.07,11.68 81.03,8.64 81.03,0.51 67.07,0.51 67.31,6.22 67.31,8.38 61.72,13.97 52.58,13.97 48.77,10.16 48.77,0.51 0.51,0.51 0.25,0.25 0.25,87.63 98.81,87.63 99.31,87.12
GNDL
  Top 0.279: 71.13,4.99 71.13,7.08
  Top 0.305: ESDCOML.3 71.79,4.32 CCOMLNG.1 71.13,4.99 | 71.13,7.08 69.82,8.38 CCOMLPG.1
LDOIN-1
  Top 0.229: 83.94,16.01 84.39,16.47
  Top 0.254: IC2.47 77.69,16.63 77.69,17.53 | 82.25,16.01 83.94,16.01
  Top 0.305: CNPN2-1.2 83.4,13.45 T2.E 83,13.74 82.06,14.69 82.06,15.82 82.25,16.01 | 84.39,16.47 84.39,17.24 83.9,17.73 77.9,17.73 77.69,17.53
MISO_ESP  (via drill 0.35)
  Top 0.305: v37.47,57.78 37.47,56.72 31.08,49.81 29.93,48.67 28.57,48.67 28.57,46.84 23.44,41.7 21.37,41.7 18.49,38.82 U2.13
  Bottom 0.305: v37.47,57.78 40.01,60.33 U$3.41-A17/MISO1
MOSI_ESP  (via drill 0.35)
  Top 0.305: v22.67,40.01 29.21,40.01 v30.8,41.59 | v41.91,43.81 45.09,46.99 U$3.26-A12/MOSI1
  Bottom 0.305: v30.8,41.59 39.69,41.59 v41.91,43.81 | U2.15 15.31,40.01 v22.67,40.01
N$1
  Top 0.152: CCOMHP.2 81.79,5.17 RCOMHP.1 78.99,7.97 ESDCOMH.1
N$2
  Top 0.305: R26.2 83.91,74.21 J3.20
N$4
  Top 0.305: R13.2 1.71,76.24 LED3.C
N$7  (via drill 0.35)
  Top 0.305: v57.41,38.61 57.36,38.66 53.09,38.66 v53.09,34.8 | v53.09,32 v48.31,32 | v60.2,40.13 61.13,40.13 62.08,39.17 67.55,39.17 S2.1
  Bottom 0.305: v60.2,40.13 58.93,40.13 v57.4,38.61 v57.41,38.61 | v53.09,34.8 v53.09,32 | v48.31,32 27.94,32 24.89,35.05 24.89,47.18 U$3.8-TX2/IN1
N$8
  Top 0.152: ESDCOMH.2 80.1,2.21 RCOMHN.1 80.61,2.16 CCOMHN.2
N$9
  Top 0.305: R12.2 14.39,74.62 LED2.C
N$10
  Top 0.152: RCOMLN.2 CCOMLNG.2 73.75,5.84 RCOML.1 73.91,6.26 74.74,7.09 74.74,8.38 74.7,8.43 74.7,16.59 IC2.41
N$11  (via drill 0.35)
  Top 0.152: R17.1 26.04,7.24 v26.16,7.37
  Bottom 0.152: v26.16,7.37 27.87,7.37 28.3,6.94 38.13,6.94 U2.22
N$13
  Top 0.305: R11.2 27.11,76.24 LED1.C
N$15
  Top 0.305: R20.1 33.47,74.26 Q1.1
N$16
  Top 0.305: R21.1 19.64,74.51 20.07,74.93 Q2.1
N$28  (via drill 0.35)
  Top 0.305: v31.11,7.62 R15.1
  Bottom 0.305: v31.11,7.62 31.11,12.62 U2.27
N$29  (via drill 0.35)
  Top 0.305: v28.57,7.62 R16.1
  Bottom 0.305: v28.57,7.62 28.57,12.62 U2.28
N$30
  Top 0.305: R23.1 6.96,74.51 Q3.1
N$31  (via drill 0.35)
  Top 0.305: v23.5,7.62 R18.1
  Bottom 0.305: v23.5,7.62 23.5,12.62 U2.30
N$32
  Top 0.305: R15.2 LED5.A
N$33
  Top 0.305: R16.2 LED6.A
N$34
  Top 0.305: R17.2 LED7.A
N$35
  Top 0.305: R18.2 LED8.A
N$49
  Top 0.152: RCOMLP.2 71.97,7.87 CCOMLPG.2 73.24,8.38 RCOML.2 73.91,10.98 74.14,11.21 74.14,16.58 IC2.40
N$67
  Top 0.152: CCOMLP.2 69.41,5.84 ESDCOML.2 69.98,6.06 RCOMLP.1
N$68
  Top 0.152: CCOMLN.2 68.14,3.37 ESDCOML.1 70.46,3.37 RCOMLN.1
N$72
  Top 0.305: R4.1 R3.2 59.5,16.51 RVC2-1.1
N$73
  Top 0.305: R2.2 47.44,10.8 49.34,10.8 52.07,13.53 R3.1 60.55,13.53 RVC1-1.1
N$75
  Top 0.305: R9.1 R4.2 58.49,19.81 RVC3-1.1
N$111
  Top 0.152: CREFHP-1.2 72.67,15.36 IC2.37
N$112
  Top 0.152: CAVDD-1.2 73.15,16.59 IC2.38
N$113
  Top 0.152: CNEG5V-1.2 76.17,15.1 IC2.44
N$114
  Top 0.152: CDVDD-1.2 82.27,18.6 IC2.49
N$130
  Top 0.305: CNPN1-1.2 90.09,17.36 88.68,15.95 87.47,15.24 T2.C | CNPN1-1.2 RNPN-1.1 | CVCC.2 90.36,17.63 CNPN1-1.2
N$131
  Top 0.152: IC2.43 75.62,16.56 75.62,6.58 RCOMH.1 77.64,6.27 RCOMHP.2 CCOMHPG.2
N$132
  Top 0.152: RCOMHN.2 CCOMHNG.2 77.05,3.46 RCOMH.2 75.17,5.33 IC2.42
NFAULT  (via drill 0.35)
  Top 0.254: IC2.62 80.18,25.12 81.12,25.12
  Top 0.305: 81.12,25.12 81.28,25.27 81.28,26.45 80.52,27.21 v80.52,30.99 | v62.23,29.46 64.35,29.46 64.64,29.18 68.37,29.18 68.73,29.53 68.73,30.04 U$1.17
  Bottom 0.305: v80.52,30.99 80.42,30.99 78.92,32.48 64.82,32.48 62.23,29.89 v62.23,29.46
NFAULT_3V3  (via drill 0.35)
  Top 0.305: U$1.4 68.78,35.95 68.78,36.51 68.46,36.83 v59.18,36.83
  Bottom 0.305: v59.18,36.83 55.4,36.83 55.17,37.06 53.6,37.06 49.5,41.15 49.5,43.46 48.89,44.08 48.89,47.87 48.24,48.52 47.16,48.52 46.39,47.75 46.39,46.94 45.5,46.05 44.6,46.05 43.76,46.88 43.76,48.01 33.52,58.25 31.6,58.25 U$3.16-A2/RX4/SCL1
NPNB-1
  Top 0.305: T2.B 78.3,16.74 IC2.48
RX_BQ  (via drill 0.35)
  Top 0.305: U$1.18 69.44,28.8 v69.34,28.7 | v82.43,20.14 82.39,20.1 IC2.52
  Bottom 0.305: v82.43,20.14 79.38,20.14 79.24,19.99 78.06,19.99 v69.34,28.7
RX_ESP  (via drill 0.35)
  Top 0.305: U2.24 47.55,21.44 47.55,32.34 51.05,35.84 v51.05,40.64
  Bottom 0.305: U$3.29-TX7 54.63,45.39 55.91,45.39 56.31,44.99 56.31,44.42 55.88,43.99 51.41,43.99 50.62,43.21 50.62,42.64 51.05,42.21 v51.05,40.64
RX_SHFT
  Top 0.305: U$3.34-RX8 57.78,61.12 51.47,54.8 51.47,46.69 59.54,38.62 68.18,38.62 69.48,37.31 69.97,37.31 70.7,36.59 70.7,35.98 U$1.1
SCK_ESP  (via drill 0.35)
  Top 0.305: v30.8,33.66 24.13,33.66 21.03,36.76 U2.12
  Bottom 0.305: v30.8,33.66 32.5,35.36 34.17,35.36 35.04,36.23 35.04,39.82 36.28,41.06 39.95,41.06 40.8,41.91 48.27,41.91 48.94,42.58 48.94,43.15 47.62,44.46 U$3.27-A13/SCK1
SHUTDOWN_IN  (via drill 0.35)
  Top 0.305: v80.52,64.26 R26.1 | v41.91,67.06 R24.2
  Bottom 0.305: v41.91,67.06 44.56,67.06 45.06,66.56 79.67,66.56 80.64,65.59 | 80.64,65.59 82.84,67.78 82.84,71.64 79.87,74.6 J3.14 | 80.64,65.59 80.64,64.38 v80.52,64.26
SHUTDOWN_SIGNAL
  Top 0.305: U$3.38-A14/CS/IN1 46.91,62.55 45.55,63.91 40.9,63.91 R24.1 R25.2
TX_BQ  (via drill 0.35)
  Top 0.254: 81.49,20.62 80.18,20.62 IC2.53
  Top 0.305: U$1.20 73.53,30.1 v73.91,29.72 | v81.9,21.03 81.49,20.62
  Bottom 0.305: v73.91,29.72 81.9,21.73 v81.9,21.03
TX_ESP  (via drill 0.35)
  Top 0.305: v50.81,45.22 50.81,44.9 51.99,43.72 51.99,43.64 52.32,43.31 52.32,42.62 51.99,42.29 51.99,34.27 53.82,32.44 53.82,25.17 U2.23
  Bottom 0.305: v50.81,45.22 50.16,45.86 U$3.28-RX7
TX_SHFT
  Top 0.305: U$3.35-TX8 55.24,59.32 49.11,53.18 49.11,50.11 49.76,49.46 49.76,48.59 48.93,47.76 48.93,46.64 49.57,45.99 51.37,45.99 59.25,38.11 67.95,38.11 69.38,36.69 69.38,36 U$1.3
VC0-1
  Top 0.305: IC2.35 IC2.34 71.18,15.73 70.95,15.49 66.89,15.49 CVC0-1.2 65.62,14.22 RVC0-1.2
VC1-1
  Top 0.305: RVC1-1.2 63.75,14.9 CVC1-1.2 63.93,16.09 CVC0-1.1 68.07,18.37 68.92,18.37 | IC2.32 68.92,18.37 | 68.92,18.37 IC2.33
VC2-1
  Top 0.305: RVC2-1.2 62.65,16.51 CVC1-1.1 64.34,18.2 CVC2-1.2 66.84,18.2 67.82,19.18 68.6,19.18 IC2.31 IC2.30
VC3-1
  Top 0.305: RVC3-1.2 65.7,19.81 CVC2-1.1 65.79,21.25 CVC3-1.2 66.94,20.6 IC2.28 IC2.29
VC4-1
  Top 0.305: RVC4-1.2 63.75,25.06 CCB10-1.1 66.04,24.8 CVC3-1.1 67.64,21.6 IC2.26 IC2.27
VC_CB_HIGH-1
  Top 0.305: IC2.1 IC2.2 IC2.3 IC2.4 | IC2.4 IC2.5 IC2.6 IC2.7 IC2.8 IC2.9 IC2.10 IC2.11 IC2.12 IC2.13 IC2.14 IC2.15 IC2.16 IC2.17 | IC2.17 IC2.18 IC2.19 IC2.20 IC2.21 IC2.22 IC2.23 IC2.24 IC2.25 | CCB10-1.2 68.03,26.76 IC2.17 | IC2.4 76.67,29.92 RBAT-1.1 77.3,30.66 CBAT-1.2
VCC  (via drill 0.35)
  Top 0.305: R9.2 61.06,24.06 RVC4-1.1 61.21,24.22 v61.21,27.94 | RBAT-1.2 78.32,31.48 v78.59,31.75 | RNPN-1.2 v95.25,17.53 | v27.18,71.63 27.11,71.69 LED1.A | v14.99,71.63 14.41,72.2 LED2.A | v2.03,71.63 1.71,71.94 LED3.A
  Top 1.346: CFET3.2 8.38,66.87 v8.38,66.8 | CFET2.2 23.94,67.06 v25.15,67.06 | CFET1.1 38.86,69.6 v39.62,68.83
  Bottom 0.305: v78.59,31.75 78.51,31.67 65.5,31.67 61.77,27.94 v61.21,27.94 | J3.1 81.03,68.64 79.45,67.07 45.33,67.07 41.97,70.42 28.38,70.42 v27.18,71.63 v14.99,71.63 v2.03,71.63
  pour Bottom: 0,65.52 92.51,65.52 93.34,66.36 93.34,87.63 92.71,88.27 0,88.27
  pour Bottom: 99.31,15.49 88.9,15.49 85.09,11.68 84.07,11.68 81.03,8.64 81.03,0.51 67.31,0.51 67.31,10.92 64.26,13.97 52.58,13.97 48.77,10.16 48.77,0.25 0.51,0.25 0.25,0.51 0.25,86.87 0.76,87.38 99.31,87.38

### Text on the board
tPlace: CONTACTORN | CONTACTORP | CONTACTORPRECHARGE | COOLING | CAN | BMS Main Board V4 | Joshua Feist / May 2023 | Low Voltage | High Voltage | COMH | High Voltage | COML